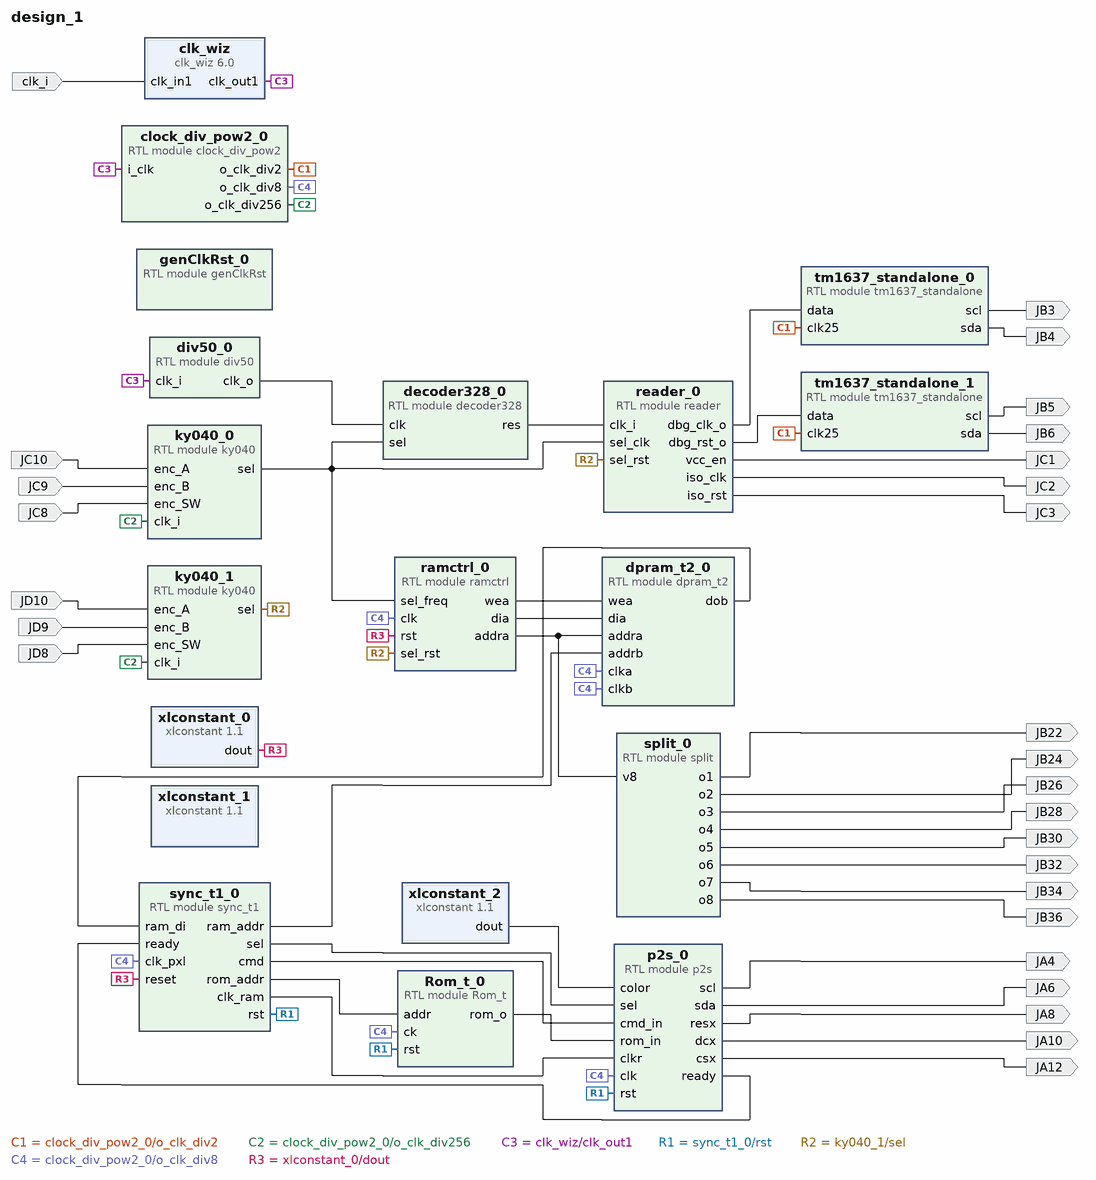
[diagram p0: block diagram of the top level]
# Vivado block design design_1, xc7a100tfgg676-2L, Vivado 2019.1
create_bd_design design_1

create_bd_port -dir O JB3
create_bd_port -dir O JB4
create_bd_port -dir O JB5
create_bd_port -dir O JB6
create_bd_port -dir I JD10
create_bd_port -dir I JD9
create_bd_port -dir I JD8
create_bd_port -dir O JA4
create_bd_port -dir O JA6
create_bd_port -dir O JA8
create_bd_port -dir O JA12
create_bd_port -dir O JA10
create_bd_port -dir O JB36
create_bd_port -dir O JB34
create_bd_port -dir O JB32
create_bd_port -dir O JB30
create_bd_port -dir O JB28
create_bd_port -dir O JB26
create_bd_port -dir O JB24
create_bd_port -dir O JB22
create_bd_port -dir I -type clk clk_i
set_property -dict {CONFIG.CLK_DOMAIN design_1_clk_i CONFIG.FREQ_HZ 100000000} [get_bd_ports clk_i]
create_bd_port -dir I JC10
create_bd_port -dir I JC9
create_bd_port -dir I JC8
create_bd_port -dir O JC1
create_bd_port -dir O -type clk JC2
create_bd_port -dir O -type rst JC3

create_bd_cell -type module -reference decoder328 decoder328_0
create_bd_cell -type module -reference div50 div50_0
create_bd_cell -type ip -vlnv xilinx.com:ip:xlconstant:1.1 xlconstant_0
set_property -dict {CONFIG.CONST_VAL 0} [get_bd_cells xlconstant_0]
create_bd_cell -type ip -vlnv xilinx.com:ip:clk_wiz:6.0 clk_wiz
create_bd_cell -type module -reference ky040 ky040_0
create_bd_cell -type module -reference ky040 ky040_1
create_bd_cell -type module -reference clock_div_pow2 clock_div_pow2_0
create_bd_cell -type module -reference split split_0
create_bd_cell -type ip -vlnv xilinx.com:ip:xlconstant:1.1 xlconstant_1
set_property -dict {CONFIG.CONST_VAL 0 CONFIG.CONST_WIDTH 8} [get_bd_cells xlconstant_1]
create_bd_cell -type ip -vlnv xilinx.com:ip:xlconstant:1.1 xlconstant_2
set_property -dict {CONFIG.CONST_VAL 0 CONFIG.CONST_WIDTH 16} [get_bd_cells xlconstant_2]
create_bd_cell -type module -reference Rom_t Rom_t_0
create_bd_cell -type module -reference genClkRst genClkRst_0
create_bd_cell -type module -reference dpram_t2 dpram_t2_0
create_bd_cell -type module -reference p2s p2s_0
create_bd_cell -type module -reference ramctrl ramctrl_0
create_bd_cell -type module -reference sync_t1 sync_t1_0
create_bd_cell -type module -reference tm1637_standalone tm1637_standalone_0
create_bd_cell -type module -reference tm1637_standalone tm1637_standalone_1
create_bd_cell -type module -reference reader reader_0

# ---- connections ----

connect_bd_net [get_bd_pins div50_0/clk_o] [get_bd_pins decoder328_0/clk]
connect_bd_net [get_bd_pins decoder328_0/res] [get_bd_pins reader_0/clk_i]
connect_bd_net [get_bd_pins clock_div_pow2_0/o_clk_div2] [get_bd_pins tm1637_standalone_0/clk25] [get_bd_pins tm1637_standalone_1/clk25]
connect_bd_net [get_bd_pins tm1637_standalone_0/scl] [get_bd_ports JB3]
connect_bd_net [get_bd_pins tm1637_standalone_0/sda] [get_bd_ports JB4]
connect_bd_net [get_bd_pins clock_div_pow2_0/o_clk_div256] [get_bd_pins ky040_0/clk_i] [get_bd_pins ky040_1/clk_i]
connect_bd_net [get_bd_pins tm1637_standalone_1/scl] [get_bd_ports JB5]
connect_bd_net [get_bd_pins tm1637_standalone_1/sda] [get_bd_ports JB6]
connect_bd_net [get_bd_pins sync_t1_0/rom_addr] [get_bd_pins Rom_t_0/addr]
connect_bd_net [get_bd_pins sync_t1_0/sel] [get_bd_pins p2s_0/sel]
connect_bd_net [get_bd_pins sync_t1_0/cmd] [get_bd_pins p2s_0/cmd_in]
connect_bd_net -net clk_i_1 [get_bd_pins clk_wiz/clk_out1] [get_bd_pins div50_0/clk_i] [get_bd_pins clock_div_pow2_0/i_clk]
connect_bd_net [get_bd_pins p2s_0/ready] [get_bd_pins sync_t1_0/ready]
connect_bd_net [get_bd_pins sync_t1_0/rst] [get_bd_pins Rom_t_0/rst] [get_bd_pins p2s_0/rst]
connect_bd_net [get_bd_pins ky040_0/sel] [get_bd_pins decoder328_0/sel] [get_bd_pins ramctrl_0/sel_freq] [get_bd_pins reader_0/sel_clk]
connect_bd_net -net JD10_1 [get_bd_ports JD10] [get_bd_pins ky040_1/enc_A]
connect_bd_net -net JD9_1 [get_bd_ports JD9] [get_bd_pins ky040_1/enc_B]
connect_bd_net -net JD8_1 [get_bd_ports JD8] [get_bd_pins ky040_1/enc_SW]
connect_bd_net [get_bd_pins ky040_1/sel] [get_bd_pins ramctrl_0/sel_rst] [get_bd_pins reader_0/sel_rst]
connect_bd_net [get_bd_pins reader_0/dbg_rst_o] [get_bd_pins tm1637_standalone_1/data]
connect_bd_net [get_bd_pins reader_0/dbg_clk_o] [get_bd_pins tm1637_standalone_0/data]
connect_bd_net [get_bd_pins p2s_0/scl] [get_bd_ports JA4]
connect_bd_net [get_bd_pins p2s_0/sda] [get_bd_ports JA6]
connect_bd_net [get_bd_pins p2s_0/resx] [get_bd_ports JA8]
connect_bd_net [get_bd_pins p2s_0/csx] [get_bd_ports JA12]
connect_bd_net [get_bd_pins p2s_0/dcx] [get_bd_ports JA10]
connect_bd_net [get_bd_pins split_0/o1] [get_bd_ports JB22]
connect_bd_net [get_bd_pins split_0/o2] [get_bd_ports JB24]
connect_bd_net [get_bd_pins split_0/o3] [get_bd_ports JB26]
connect_bd_net [get_bd_pins split_0/o4] [get_bd_ports JB28]
connect_bd_net [get_bd_pins split_0/o5] [get_bd_ports JB30]
connect_bd_net [get_bd_pins split_0/o6] [get_bd_ports JB32]
connect_bd_net [get_bd_pins split_0/o7] [get_bd_ports JB34]
connect_bd_net [get_bd_pins split_0/o8] [get_bd_ports JB36]
connect_bd_net [get_bd_pins xlconstant_2/dout] [get_bd_pins p2s_0/color]
connect_bd_net [get_bd_pins clock_div_pow2_0/o_clk_div8] \
  [get_bd_pins Rom_t_0/ck] [get_bd_pins dpram_t2_0/clka] [get_bd_pins dpram_t2_0/clkb] [get_bd_pins p2s_0/clk] \
  [get_bd_pins ramctrl_0/clk] [get_bd_pins sync_t1_0/clk_pxl]
connect_bd_net [get_bd_pins sync_t1_0/ram_addr] [get_bd_pins dpram_t2_0/addrb]
connect_bd_net [get_bd_pins dpram_t2_0/dob] [get_bd_pins sync_t1_0/ram_di]
connect_bd_net [get_bd_pins sync_t1_0/clk_ram] [get_bd_pins p2s_0/clkr]
connect_bd_net [get_bd_ports clk_i] [get_bd_pins clk_wiz/clk_in1]
connect_bd_net [get_bd_pins xlconstant_0/dout] [get_bd_pins ramctrl_0/rst] [get_bd_pins sync_t1_0/reset]
connect_bd_net [get_bd_pins ramctrl_0/wea] [get_bd_pins dpram_t2_0/wea]
connect_bd_net [get_bd_pins ramctrl_0/dia] [get_bd_pins dpram_t2_0/dia]
connect_bd_net [get_bd_pins ramctrl_0/addra] [get_bd_pins split_0/v8] [get_bd_pins dpram_t2_0/addra]
connect_bd_net [get_bd_pins Rom_t_0/rom_o] [get_bd_pins p2s_0/rom_in]
connect_bd_net -net JC10_1 [get_bd_ports JC10] [get_bd_pins ky040_0/enc_A]
connect_bd_net -net JC9_1 [get_bd_ports JC9] [get_bd_pins ky040_0/enc_B]
connect_bd_net -net JC8_1 [get_bd_ports JC8] [get_bd_pins ky040_0/enc_SW]
connect_bd_net [get_bd_pins reader_0/vcc_en] [get_bd_ports JC1]
connect_bd_net [get_bd_pins reader_0/iso_clk] [get_bd_ports JC2]
connect_bd_net [get_bd_pins reader_0/iso_rst] [get_bd_ports JC3]

validate_bd_design
save_bd_design
